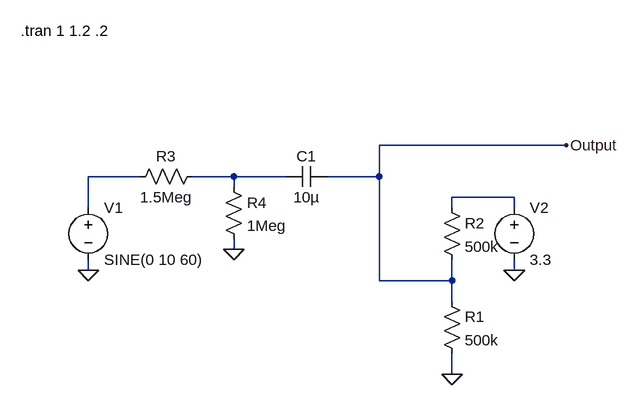
[diagram p0: schematic Voltage Analyzer.asc]
Voltage Analyzer.asc, the LTspice schematic file:
Version 4
SHEET 1 880 680
WIRE 784 224 496 224
WIRE 128 272 48 272
WIRE 272 272 208 272
WIRE 352 272 272 272
WIRE 496 272 496 224
WIRE 496 272 416 272
WIRE 272 288 272 272
WIRE 704 304 608 304
WIRE 48 320 48 272
WIRE 608 320 608 304
WIRE 704 320 704 304
WIRE 272 384 272 368
WIRE 48 416 48 400
WIRE 704 416 704 400
WIRE 496 432 496 272
WIRE 608 432 608 400
WIRE 608 432 496 432
WIRE 608 464 608 432
WIRE 608 576 608 544
FLAG 48 416 0
FLAG 608 576 0
FLAG 704 416 0
FLAG 272 384 0
FLAG 784 224 Output
SYMBOL voltage 48 304 R0
SYMATTR InstName V1
SYMATTR Value SINE(0 10 60)
SYMBOL cap 416 256 R90
WINDOW 0 0 32 VBottom 2
WINDOW 3 32 32 VTop 2
SYMATTR InstName C1
SYMATTR Value 10µ
SYMBOL res 592 448 R0
SYMATTR InstName R1
SYMATTR Value 500k
SYMBOL res 592 304 R0
SYMATTR InstName R2
SYMATTR Value 500k
SYMBOL voltage 704 304 R0
SYMATTR InstName V2
SYMATTR Value 3.3
SYMBOL res 224 256 R90
WINDOW 0 0 56 VBottom 2
WINDOW 3 32 56 VTop 2
SYMATTR InstName R3
SYMATTR Value 1.5Meg
SYMBOL res 256 272 R0
SYMATTR InstName R4
SYMATTR Value 1Meg
TEXT -56 48 Left 2 !.tran 1 1.2 .2

The netlist it stands for:
* Voltage Analyzer.asc
V1 N001 0 SINE(0 10 60)
C1 Output N002 10µ
R1 Output 0 500k
R2 N003 Output 500k
V2 N003 0 3.3
R3 N002 N001 1.5Meg
R4 N002 0 1Meg
.tran 1 1.2 .2
.backanno
.end